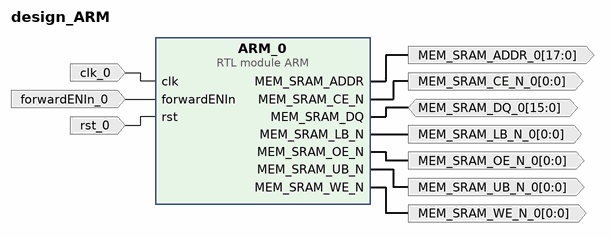
[diagram p0: block diagram of the top level]
# Vivado block design design_ARM, xc7z010clg400-1, Vivado 2018.3
create_bd_design design_ARM

create_bd_port -dir O -from 17 -to 0 MEM_SRAM_ADDR_0
create_bd_port -dir O -from 0 -to 0 MEM_SRAM_CE_N_0
create_bd_port -dir IO -from 15 -to 0 MEM_SRAM_DQ_0
create_bd_port -dir O -from 0 -to 0 MEM_SRAM_LB_N_0
create_bd_port -dir O -from 0 -to 0 MEM_SRAM_OE_N_0
create_bd_port -dir O -from 0 -to 0 MEM_SRAM_UB_N_0
create_bd_port -dir O -from 0 -to 0 MEM_SRAM_WE_N_0
create_bd_port -dir I -type clk clk_0
create_bd_port -dir I forwardENIn_0
create_bd_port -dir I -type rst rst_0

create_bd_cell -type module -reference ARM ARM_0

# ---- connections ----

connect_bd_net [get_bd_pins ARM_0/MEM_SRAM_ADDR] [get_bd_ports MEM_SRAM_ADDR_0]
connect_bd_net [get_bd_pins ARM_0/MEM_SRAM_CE_N] [get_bd_ports MEM_SRAM_CE_N_0]
connect_bd_net [get_bd_ports MEM_SRAM_DQ_0] [get_bd_pins ARM_0/MEM_SRAM_DQ]
connect_bd_net [get_bd_pins ARM_0/MEM_SRAM_LB_N] [get_bd_ports MEM_SRAM_LB_N_0]
connect_bd_net [get_bd_pins ARM_0/MEM_SRAM_OE_N] [get_bd_ports MEM_SRAM_OE_N_0]
connect_bd_net [get_bd_pins ARM_0/MEM_SRAM_UB_N] [get_bd_ports MEM_SRAM_UB_N_0]
connect_bd_net [get_bd_pins ARM_0/MEM_SRAM_WE_N] [get_bd_ports MEM_SRAM_WE_N_0]
connect_bd_net -net clk_0_1 [get_bd_ports clk_0] [get_bd_pins ARM_0/clk]
connect_bd_net -net forwardENIn_0_1 [get_bd_ports forwardENIn_0] [get_bd_pins ARM_0/forwardENIn]
connect_bd_net -net rst_0_1 [get_bd_ports rst_0] [get_bd_pins ARM_0/rst]

validate_bd_design
save_bd_design
